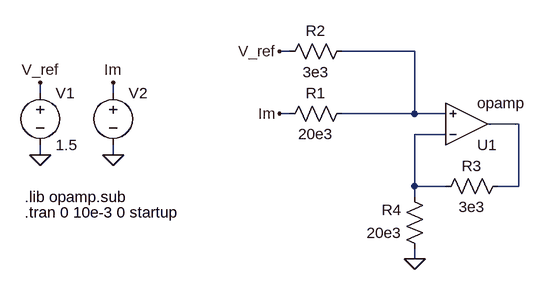
[diagram p0: schematic noninv-amplifier-im.asc]
noninv-amplifier-im.asc, the LTspice schematic file:
Version 4
SHEET 1 880 680
WIRE 208 0 192 0
WIRE 400 0 288 0
WIRE -176 64 -176 48
WIRE -64 64 -64 48
WIRE 208 96 192 96
WIRE 400 96 400 0
WIRE 400 96 288 96
WIRE 448 96 400 96
WIRE 560 112 512 112
WIRE 448 128 400 128
WIRE -176 160 -176 144
WIRE -64 160 -64 144
WIRE 400 208 400 128
WIRE 448 208 400 208
WIRE 560 208 560 112
WIRE 560 208 528 208
WIRE 400 224 400 208
WIRE 400 320 400 304
FLAG -176 160 0
FLAG 400 320 0
FLAG -176 48 V_ref
FLAG -64 160 0
FLAG -64 48 Im
FLAG 192 0 V_ref
FLAG 192 96 Im
SYMBOL OpAmps\\opamp 480 176 M180
SYMATTR InstName U1
SYMBOL res 304 80 R90
WINDOW 0 0 56 VBottom 2
WINDOW 3 32 56 VTop 2
SYMATTR InstName R1
SYMATTR Value 20e3
SYMBOL res 304 -16 R90
WINDOW 0 0 56 VBottom 2
WINDOW 3 32 56 VTop 2
SYMATTR InstName R2
SYMATTR Value 3e3
SYMBOL voltage -176 48 R0
WINDOW 39 0 0 Left 0
SYMATTR InstName V1
SYMATTR Value 1.5
SYMATTR Value2 AC 1
SYMBOL res 544 192 R90
WINDOW 0 0 56 VBottom 2
WINDOW 3 32 56 VTop 2
SYMATTR InstName R3
SYMATTR Value 3e3
SYMBOL res 416 320 R180
WINDOW 0 36 76 Left 2
WINDOW 3 36 40 Left 2
SYMATTR InstName R4
SYMATTR Value 20e3
SYMBOL voltage -64 48 R0
WINDOW 39 0 0 Left 0
WINDOW 3 24 96 Invisible 2
SYMATTR Value SINE(0 10 1e3)
SYMATTR InstName V2
SYMATTR Value2 AC 1
TEXT -200 224 Left 2 !.lib opamp.sub
TEXT -200 248 Left 2 !.tran 0 10e-3 0 startup

The netlist it stands for:
* noninv-amplifier-im.asc
XU1 N003 N001 N002 opamp Aol=100K GBW=10Meg  ; pins invin noninvin out
R1 N001 Im 20e3
R2 N001 V_ref 3e3
V1 V_ref 0 1.5 AC 1
R3 N002 N003 3e3
R4 0 N003 20e3
V2 Im 0 SINE(0 10 1e3) AC 1
.lib opamp.sub
.tran 0 10e-3 0 startup
.backanno
.end